# EAGLE design SnowBoard2 (EAGLE 8.1.1)
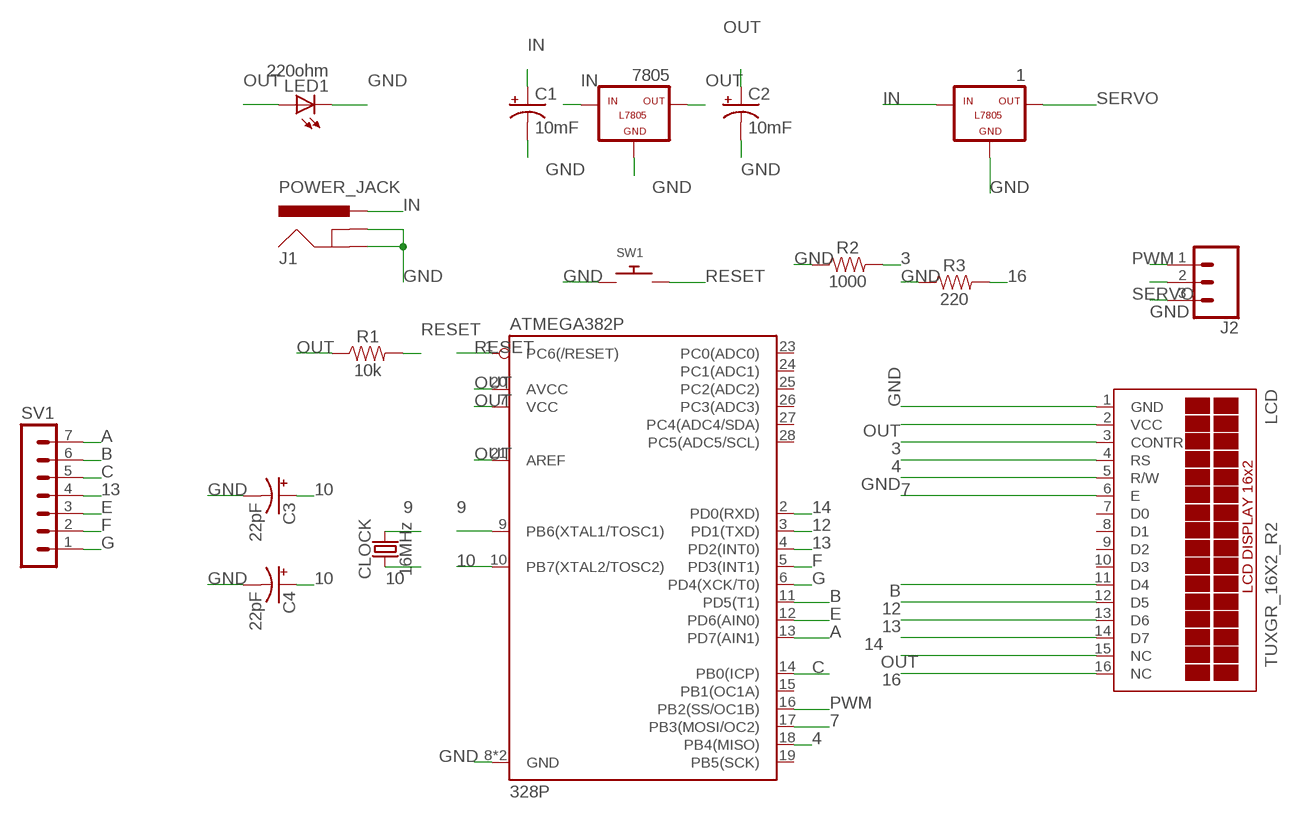
[diagram p0: schematic, sheet 1]

## Parts
1  L7805  [78XXL]
7805  L7805  [78XXL]
ATMEGA382P  328P  ATMEGA328P_PDIP  [DIP28]
C1  10mF  1000UF-RADIAL-5MM-25V-20%  [CPOL-RADIAL-5MM-10MM]
C2  10mF  1000UF-RADIAL-5MM-25V-20%  [CPOL-RADIAL-5MM-10MM]
C3  22pF  1000UF-RADIAL-5MM-25V-20%  [CPOL-RADIAL-5MM-10MM]
C4  22pF  1000UF-RADIAL-5MM-25V-20%  [CPOL-RADIAL-5MM-10MM]
CLOCK  16MHz  CRYSTAL-16MHZPTH-HC49US  [HC49US]
J1  POWER_JACK  [POWER_JACK_PTH]
J2  CONN_03-SCREW-5MM  [SCREWTERMINAL-5MM-3]
LCD  TUXGR_16X2_R2  [TUXGR_16X2_R2]
LED1  220ohm  LED5MM  [LED5MM]
R1  10k  1KOHM-VERT-1/4W-5%  [AXIAL-0.1]
R2  1000  100OHM-VERT_KIT-1/4W-1%  [AXIAL-0.1-KIT]
R3  220  100OHM-VERT_KIT-1/4W-1%  [AXIAL-0.1-KIT]
SV1  MA07-1  [MA07-1]
SW1  SWITCH_PUSHBUTTONEVQ-PE  [TACT_PANA-EVQ]

## Nets
3: LCD.3(CONTR) R2.P$2
4: ATMEGA382P.18(PB4(MISO)) LCD.4(RS)
7: ATMEGA382P.17(PB3(MOSI/OC2)) LCD.6(E)
9: ATMEGA382P.9(PB6(XTAL1/TOSC1)) CLOCK.2
10: ATMEGA382P.10(PB7(XTAL2/TOSC2)) C3.+ C4.+ CLOCK.1
12: ATMEGA382P.3(PD1(TXD)) LCD.12(D5)
13: ATMEGA382P.4(PD2(INT0)) LCD.13(D6) SV1.4
14: ATMEGA382P.2(PD0(RXD)) LCD.14(D7)
16: LCD.16(NC) R3.P$2
A: ATMEGA382P.13(PD7(AIN1)) SV1.7
B: ATMEGA382P.11(PD5(T1)) LCD.11(D4) SV1.6
C: ATMEGA382P.14(PB0(ICP)) SV1.5
E: ATMEGA382P.12(PD6(AIN0)) SV1.3
F: ATMEGA382P.5(PD3(INT1)) SV1.2
G: ATMEGA382P.6(PD4(XCK/T0)) SV1.1
GND: 1.GND 7805.GND ATMEGA382P.8(GND) ATMEGA382P.22(GND) C1.- C2.- C3.- C4.- J1.GND J1.GNDBREAK J2.3 LCD.1(GND) LCD.5(R/W) LED1.K(C) R2.P$1 R3.P$1 SW1.P$1
IN: 1.IN 7805.IN C1.+ J1.PWR
OUT: 7805.OUT ATMEGA382P.7(VCC) ATMEGA382P.20(AVCC) ATMEGA382P.21(AREF) C2.+ LCD.2(VCC) LCD.15(NC) LED1.A R1.P$1
PWM: ATMEGA382P.16(PB2(SS/OC1B)) J2.1
RESET: ATMEGA382P.1(PC6(/RESET)) R1.P$2 SW1.P$2
SERVO: 1.OUT J2.2
Unconnected: ATMEGA382P.15(PB1(OC1A)) ATMEGA382P.19(PB5(SCK)) ATMEGA382P.23(PC0(ADC0)) ATMEGA382P.24(PC1(ADC1)) ATMEGA382P.25(PC2(ADC2)) ATMEGA382P.26(PC3(ADC3)) ATMEGA382P.27(PC4(ADC4/SDA)) ATMEGA382P.28(PC5(ADC5/SCL)) LCD.7(D0) LCD.8(D1) LCD.9(D2) LCD.10(D3)

## Library data of the parts
1 7805 = tango:L7805: VOLTAGE REGULATOR
ATMEGA382P = SparkFun-IC-Microcontroller:ATMEGA328P_PDIP: Atmel 328P Through hole ATMEGA328P uC used in the Arduino 32kb flash, 1k EEPROM, 2k SRAM Datasheet <http://www.sparkfun.com/datasheets/Components/SMD/ATMega328.pdf> SparkFun Products Storefront component: AVR 28 Pin 20MHz 32K 6A/D - ATMega328P <https://www.sparkfun.com/products/9061> (COM-09061) SparkFun Simon Says - Through-Hole Soldering Kit <https://www.sparkfun.com/products/10547> (KIT-10547) SparkFun Learn to Solder - Simon Says <https://www.sparkfun.com/products/13708> (KIT-13708) SparkFun BigTime Watch Kit <https://www.sparkfun.com/products/11734> (KIT-11734) SparkFun ClockIt <https://www.sparkfun.com/products/10930> (KIT-10930) SparkFun Serial Enabled LCD Kit <https://www.sparkfun.com/products/10097> (LCD-10097) SparkFun Simon Tilts - Through Hole Soldering Kit <https://www.sparkfun.com/products/12634> (KIT-12634) SparkFun Frequency Counter Kit <https://www.sparkfun.com/products/10140> (KIT-10140) FabFM Radio Kit <https://www.sparkfun.com/products/11043> (KIT-11043) SparkFun Binary Blaster Kit <https://www.sparkfun.com/products/12037> (KIT-12037) SparkFun Metro-Gnome <https://www.sparkfun.com/products/9236> (KIT-09236) ATmega328 with Arduino Optiboot (Uno) <https://www.sparkfun.com/products/10524> (DEV-10524); PROD_ID: IC-09136
C1-C4 = SparkFun-Capacitors:1000UF: 1,000µF/1mF ceramic capacitors A capacitor is a passive two-terminal electrical component used to store electrical energy temporarily in an electric field. CAP-08070; PROD_ID: CAP-09538; VALUE: 1mF
CLOCK = SparkFun-Clocks:CRYSTAL-16MHZ: 16MHz Crystal Digikey Example <http://www.digikey.com/product-search/en?keywords=535-9122-1-ND> Frequency: 16MHz Frequency Stability: ±50ppm Frequency Tolerance: ±20ppm Load Capacitance: 18pF SparkFun Products: Pro Micro -5V/16MHz <https://www.sparkfun.com/products/12640> SparkFun Serial Enabled LCD Kit <https://www.sparkfun.com/products/10097>; PROD_ID: XTAL-08181; SF_ID: COM-00536
J1 = POWER_JACKPTH:POWER_JACK: Power Jack Connector This is the standard 5.5mm barrel jack for power. The PTH is the most common, proven, reliable, footprint. The Slot footprint only works if the mill layer is transmitted to the PCB fab house so be warned. Here are the connectors we sell at SparkFun: DC Barrel Power Jack/Connector <https://www.sparkfun.com/products/119> (PRT-00119) DC Barrel Power Jack/Connector (SMD) <https://www.sparkfun.com/products/12748> (PRT-12748) DC Barrel Jack Adapter - Breadboard Compatible <https://www.sparkfun.com/products/10811> (PRT-10811) It is used on this SparkFun product (and many, many others): SparkFun RedBoard - Programmed with Arduino <https://www.sparkfun.com/products/12757> (DEV-12757) Also, if you need a mating power supply or connector, please check these out: Wall Adapter Power Supply - 9VDC 650mA <https://www.sparkfun.com/products/298> (TOL-00298) DC Barrel Jack Adapter - Male <https://www.sparkfun.com/products/10287> (PRT-10287); PROD_ID: CONN-08197
J2 = SparkFun-Connectors:CONN_03: Multi connection point. Often used as Generic Header-pin footprint for 0.1 inch spaced/style header connections On any of the 0.1 inch spaced packages, you can populate with these: Break Away Headers - Straight <https://www.sparkfun.com/products/116> (PRT-00116) Break Away Male Headers - Right Angle <https://www.sparkfun.com/products/553> (PRT-00553) Female Headers <https://www.sparkfun.com/products/115> (PRT-00115) Break Away Headers - Machine Pin <https://www.sparkfun.com/products/117> (PRT-00117) Break Away Female Headers - Swiss Machine Pin <https://www.sparkfun.com/products/743> (PRT-00743) Stackable Header - 3 Pin (Female, 0.1") <https://www.sparkfun.com/products/13875> (PRT-13875) For SCREWTERMINALS and SPRING TERMINALS visit here: Screw Terimnals on SparkFun.com <https://www.sparkfun.com/search/results?term=Screw+Terminals> (5mm/3.5mm/2.54mm spacing) This device is also useful as a general connection point to wire up your design to another part of your project. Our various solder wires solder well into these plated through hole pads. Hook-Up Wire - Assortment (Stranded, 22 AWG) <https://www.sparkfun.com/products/11375> (PRT-11375) Hook-Up Wire - Assortment (Solid Core, 22 AWG) <https://www.sparkfun.com/products/11367> (PRT-11367) View the entire wire category on our website here <https://www.sparkfun.com/categories/141> Special notes: Molex polarized connector foot print use with SKU : PRT-08232 with associated crimp pins and housings.; PROD_ID: CONN-10134; SF_SKU: PRT-08433
LCD = display-lcd:TUXGR_16X2_R2: Tuxgraphics LCD display 16x2 characters reflective, without background light Source: tuxgr_12x2_r2.pdf; OC_FARNELL: unknown; OC_NEWARK: unknown
LED1 = adafruit:LED: LED OSRAM: - CHIPLED LG R971, LG N971, LY N971, LG Q971, LY Q971, LO R971, LY R971 LH N974, LH R974 LS Q976, LO Q976, LY Q976 LO Q996 - Hyper CHIPLED LW Q18S LB Q993, LB Q99A, LB R99A - SideLED LS A670, LO A670, LY A670, LG A670, LP A670 LB A673, LV A673, LT A673, LW A673 LH A674 LY A675 LS A676, LA A676, LO A676, LY A676, LW A676 LS A679, LY A679, LG A679 - Hyper Micro SIDELED® LS Y876, LA Y876, LO Y876, LY Y876 LT Y87S - SmartLED LW L88C, LW L88S LB L89C, LB L89S, LG L890 LS L89K, LO L89K, LY L89K LS L896, LA L896, LO L896, LY L896 - TOPLED LS T670, LO T670, LY T670, LG T670, LP T670 LSG T670, LSP T670, LSY T670, LOP T670, LYG T670 LG T671, LOG T671, LSG T671 LB T673, LV T673, LT T673, LW T673 LH T674 LS T676, LA T676, LO T676, LY T676, LB T676, LH T676, LSB T676, LW T676 LB T67C, LV T67C, LT T67C, LS T67K, LO T67K, LY T67K, LW E67C LS E67B, LA E67B, LO E67B, LY E67B, LB E67C, LV E67C, LT E67C LW T67C LS T679, LY T679, LG T679 LS T770, LO T770, LY T770, LG T770, LP T770 LB T773, LV T773, LT T773, LW T773 LH T774 LS E675, LA E675, LY E675, LS T675 LS T776, LA T776, LO T776, LY T776, LB T776 LHGB T686 LT T68C, LB T68C - Hyper Mini TOPLED® LB M676 - Mini TOPLED Santana® LG M470 LS M47K, LO M47K, LY M47K Source: http://www.osram.convergy.de/
R1 = SparkFun-Resistors:1KOHM: 1kΩ resistor A resistor is a passive two-terminal electrical component that implements electrical resistance as a circuit element. Resistors act to reduce current flow, and, at the same time, act to lower voltage levels within circuits. - Wikipedia; PROD_ID: RES-08380; VALUE: 1k
R2 R3 = SparkFun-Resistors:100OHM: 100Ω resistor A resistor is a passive two-terminal electrical component that implements electrical resistance as a circuit element. Resistors act to reduce current flow, and, at the same time, act to lower voltage levels within circuits. - Wikipedia; PROD_ID: RES-12181; VALUE: 100
SV1 = con-lstb:MA07-1: PIN HEADER; OC_FARNELL: unknown; OC_NEWARK: unknown
SW1 = adafruit:SWITCH_PUSHBUTTON: Buttons SOFTTOUCHSMD_SJ - Soft touch temporary push button (Super Junk Akihabara) Compatible with SKPMANE010 [Mouser: 688-SKPMAN] C&K_KSS = Digikey: KSS221GLFS

## Board
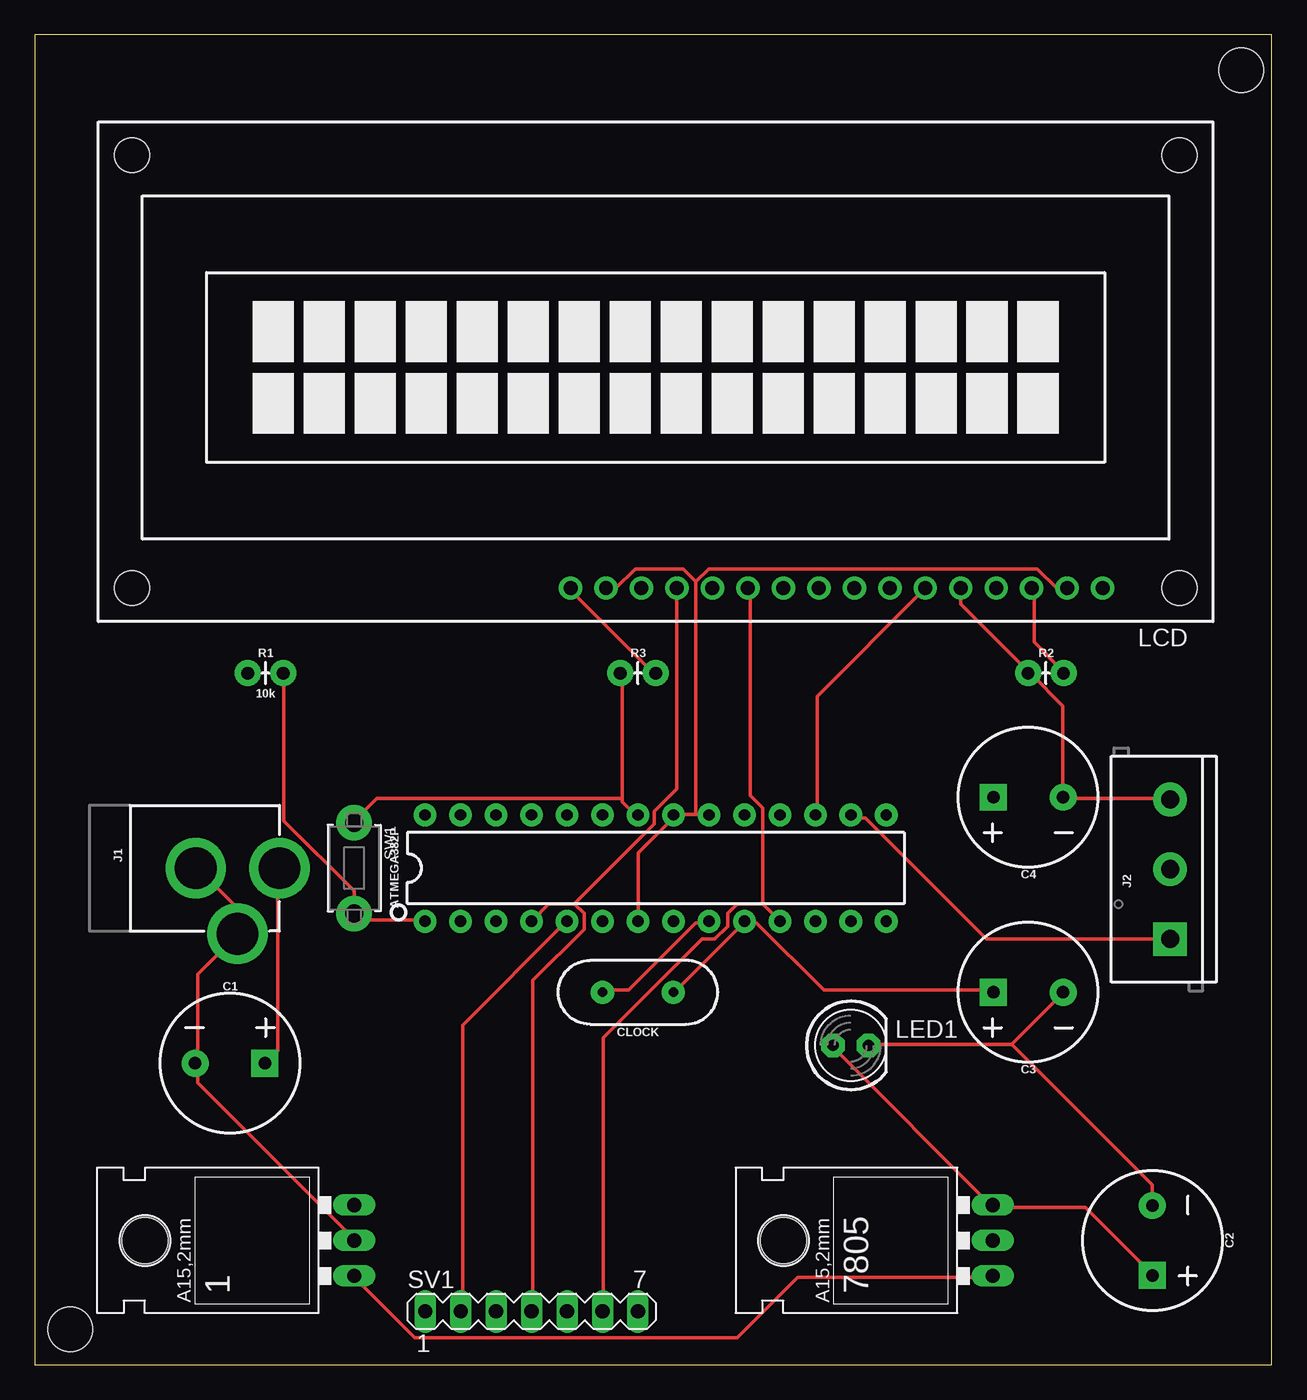
[diagram p1: board, top side]
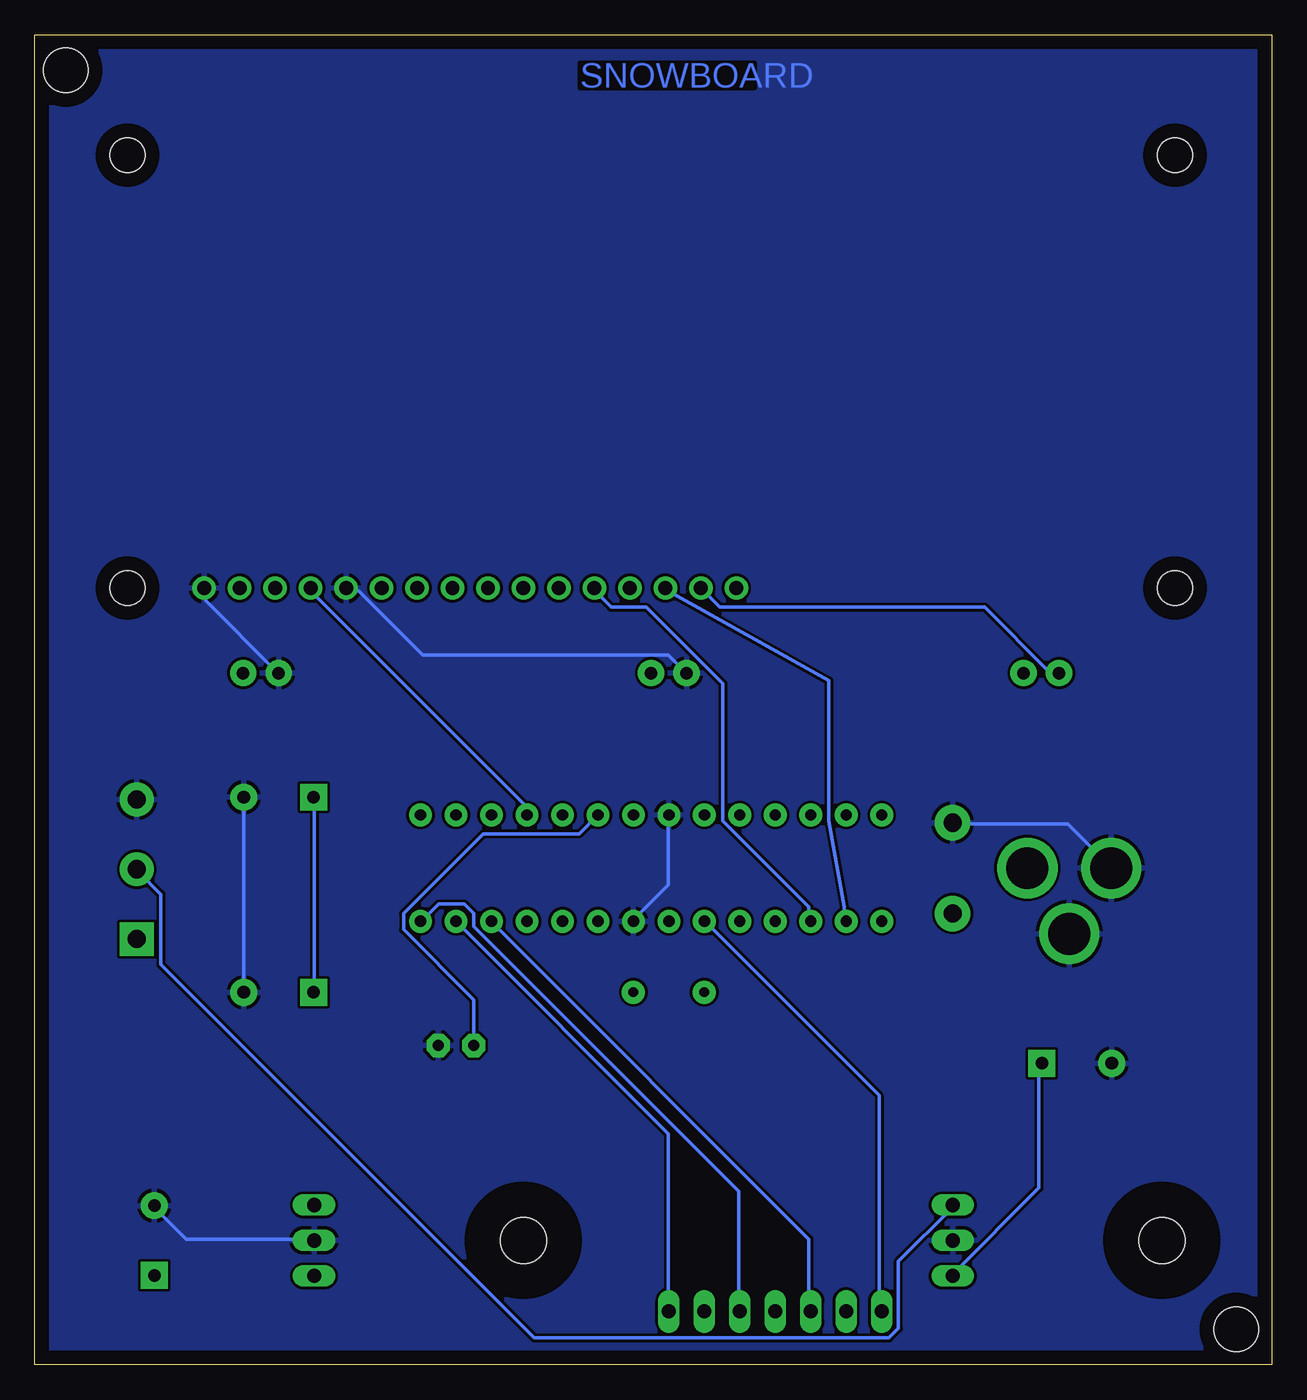
[diagram p2: board, bottom side, seen from below]

Size 88.57 x 95.24 mm. Coordinates in mm from the lower left corner, seen from the top.
Outline: 0,0 88.57,0 88.57,95.24 0,95.24 0,0
Copper layers (1*16): Top 0.045mm / dielectric 2mm / Bottom 0.045mm
Design rules "default *": minimum track width 10mil, minimum drill 24mil, track to track 8mil, track to pad 8mil, pad to pad 8mil, via to via 8mil, smd to smd 8mil, copper to edge 40mil, drill to drill 8mil, minimum pad ring 10mil, minimum via ring 8mil, stop-mask expansion 4mil, vias tented up to drill 0mil, thermal gap 10mil
Holes 3.2 mm at 2.54,2.54 86.36,92.71

### Footprints (pad centres in the part's own frame; a part is rotated, then mirrored left to right if it is on the bottom)
78XXL = drill 1.016 long: GND 0,-3.81; IN -2.54,-3.81; OUT 2.54,-3.81 | hole 3.302: 0,11.176
DIP28 = drill 0.813 pad 1.626: 1 -16.51,-3.81; 2 -13.97,-3.81; 3 -11.43,-3.81; 4 -8.89,-3.81; 5 -6.35,-3.81; 6 -3.81,-3.81; 7 -1.27,-3.81; 8 1.27,-3.81; 9 3.81,-3.81; 10 6.35,-3.81; 11 8.89,-3.81; 12 11.43,-3.81; 13 13.97,-3.81; 14 16.51,-3.81; 15 16.51,3.81; 16 13.97,3.81; 17 11.43,3.81; 18 8.89,3.81; 19 6.35,3.81; 20 3.81,3.81; 21 1.27,3.81; 22 -1.27,3.81; 23 -3.81,3.81; 24 -6.35,3.81; 25 -8.89,3.81; 26 -11.43,3.81; 27 -13.97,3.81; 28 -16.51,3.81
CPOL-RADIAL-5MM-10MM = drill 0.9 pad 1.93 square: + 2.5,0 | drill 0.9 pad 1.93: - -2.5,0
HC49US = drill 0.7 pad 1.651: 1 -2.54,0; 2 2.54,0
POWER_JACK_PTH = drill 2.997 pad 4.318: GND 0,7.7; GNDBREAK 4.7,10.7; PWR 0,13.7
SCREWTERMINAL-5MM-3 = drill 1.3 pad 2.413 square: 1 0,0 | drill 1.3 pad 2.413: 2 5,0; 3 10,0
TUXGR_16X2_R2 = drill 1 pad 1.676: 1 -32,15.5; 2 -29.46,15.5; 3 -26.92,15.5; 4 -24.38,15.5; 5 -21.84,15.5; 6 -19.3,15.5; 7 -16.76,15.5; 8 -14.22,15.5; 9 -11.68,15.5; 10 -9.14,15.5; 11 -6.6,15.5; 12 -4.06,15.5; 13 -1.52,15.5; 14 1.02,15.5; 15 3.56,15.5; 16 6.1,15.5 | hole 2.5: -37.5,-15.5; 37.5,-15.5; -37.5,15.5; 37.5,15.5
LED5MM = drill 0.813 pad 1.676 octagon: A -1.27,0; K 1.27,0
AXIAL-0.1 = drill 0.9 pad 1.88: P$1 -1.27,0; P$2 1.27,0
AXIAL-0.1-KIT = drill 0.9 pad 1.88: P$1 -1.27,0; P$2 1.27,0
MA07-1 = drill 1.016 long: 1 -7.62,0; 2 -5.08,0; 3 -2.54,0; 4 0,0; 5 2.54,0; 6 5.08,0; 7 7.62,0
TACT_PANA-EVQ = drill 1.3 pad 2.54: P$1 -3.25,0; P$2 3.25,0

### Placement (x,y rotation side)
1  19.05,8.89 90 top
7805  64.77,8.89 90 top
ATMEGA382P  44.45,35.56 0 top
C1  13.97,21.59 0 top
C2  80.01,8.89 270 top
C3  71.12,26.67 180 top
C4  71.12,40.64 180 top
CLOCK  43.18,26.67 180 top
J1  3.81,35.56 270 top
J2  81.28,30.48 90 top
LCD  44.45,71.12 180 top
LED1  58.42,22.86 0 top
R1  16.51,49.53 0 top
R2  72.39,49.53 0 top
R3  43.18,49.53 0 top
SV1  35.56,3.81 0 top
SW1  22.86,35.56 270 top

### Tracks (layer width: path | path; a pad name or v marks a point on that pad's centre or on a via)
3
  Top 0.254: LCD.3 71.55,55.4 71.55,51.74 73.61,49.68 R2.P$2
4
  Bottom 0.254: ATMEGA382P.18 53.49,39.39 53.49,40.08 68.81,55.4 LCD.4
7
  Top 0.254: ATMEGA382P.17 56.01,39.39 56.01,47.85 63.55,55.4 LCD.6
9
  Top 0.254: ATMEGA382P.9 48.23,31.62 47.32,31.62 42.52,26.82 40.69,26.82 CLOCK.2
10
  Top 0.254: CLOCK.1 45.72,26.59 50.75,31.62 ATMEGA382P.10 50.98,31.62 51.66,31.62 56.46,26.82 68.58,26.82 C3.+
  Bottom 0.254: C3.+ 68.58,26.82 68.58,40.54 C4.+
12
  Bottom 0.254: ATMEGA382P.3 33.15,31.85 33.15,32.77 39.32,38.94 39.32,48.77 44.81,54.25 47.32,54.25 48.46,55.4 LCD.12
13
  Top 0.254: 38.63,32.99 39.32,32.31 39.32,31.17 35.66,27.51 35.66,3.96 SV1.4 | 38.63,32.99 36.8,32.99 ATMEGA382P.4 | 38.63,32.99 44.35,38.71 44.35,39.62 45.95,41.22 45.95,55.4 LCD.13
14
  Bottom 0.254: ATMEGA382P.2 30.63,31.85 30.63,32.77 31.73,38.94 31.73,49 43.2,55.4 LCD.14
16
  Top 0.254: LCD.16 38.41,55.4 44.35,49.45 R3.P$2
A
  Bottom 0.254: ATMEGA382P.13 43.2,16.53 43.2,3.96 SV1.7
B
  Top 0.254: 52.12,32.99 50.29,32.99 49.61,32.31 49.61,31.39 48.69,30.48 47.78,30.48 40.69,23.39 40.69,3.96 SV1.6 | 52.12,32.99 53.26,31.85 ATMEGA382P.11 | 52.12,32.99 52.12,39.85 51.21,40.77 51.21,55.4 LCD.11
C
  Bottom 0.254: SV1.5 38.18,3.96 38.18,12.42 57.15,31.39 57.15,32.31 57.84,32.99 59.66,32.99 60.81,31.85 ATMEGA382P.14
E
  Bottom 0.254: SV1.3 33.15,3.96 33.15,8.99 55.78,31.62 ATMEGA382P.12
F
  Top 0.254: SV1.2 30.63,3.96 30.63,24.31 37.95,31.62 ATMEGA382P.5
G
  Bottom 0.254: SV1.1 28.12,3.96 28.12,19.28 40.46,31.62 ATMEGA382P.6
GND
  Top 0.254: J2.3 81.15,40.54 73.84,40.54 C4.- 73.61,40.77 73.61,47.17 71.32,49.45 R2.P$1 71.09,49.68 66.29,54.48 66.29,55.4 LCD.5 | 69.95,22.94 59.89,22.94 LED1.K | 69.95,22.94 73.61,26.59 C3.- | C2.- 80.01,12.88 69.95,22.94 | 1.GND 22.86,8.99 11.66,20.19 11.66,21.56 C1.- 11.66,21.79 11.66,27.96 14.4,30.71 J1.GNDBREAK 14.4,30.94 14.4,32.77 11.66,35.51 J1.GND | 42.06,40.54 42.06,40.31 42.98,39.39 ATMEGA382P.22 | 42.06,40.54 42.06,49.45 R3.P$1 | 42.06,40.54 24.46,40.54 22.86,38.94 SW1.P$1
  Bottom 0.254: LCD.1 76.35,55.4 76.35,54.71 71.32,49.68 R2.P$1 | 7805.GND 68.58,8.99 77.72,8.99 80.01,11.28 C2.- | C4.- 73.61,40.54 73.61,26.82 C3.- | ATMEGA382P.22 43.2,39.17 43.2,34.37 45.72,31.85 ATMEGA382P.8 | SW1.P$1 22.86,38.71 14.63,38.71 11.66,35.74 J1.GND | R3.P$1 43.2,50.82 60.81,50.82 65.38,55.4 66.06,55.4 LCD.5
  pour Bottom: -1.27,96.52 90.17,96.52 90.17,-2.54 -1.27,-2.54
IN
  Top 0.254: 7805.IN 68.58,6.25 54.63,6.25 50.29,1.9 27.2,1.9 22.86,6.25 1.IN | J1.PWR 17.37,35.51 17.37,22.48 16.69,21.79 C1.+
  Bottom 0.254: 1.IN 22.86,6.48 16.69,12.65 16.69,21.56 C1.+
OUT
  Top 0.254: 68.58,11.28 75.21,11.28 80.01,6.48 C2.+ | 68.58,11.28 57.15,22.71 LED1.A | 68.58,11.28 7805.OUT | ATMEGA382P.7 43.2,31.85 43.2,36.65 45.72,39.17 ATMEGA382P.21 45.72,39.39 47.32,39.39 | 47.32,39.39 48.23,39.39 ATMEGA382P.20 | 47.32,56.08 46.41,57 42.98,57 41.61,55.63 40.92,55.63 LCD.15 | 47.32,39.39 47.32,56.08 | 47.32,56.08 48.23,57 71.78,57 73.15,55.63 73.84,55.63 LCD.2
  Bottom 0.254: R1.P$1 15.32,49.68 16,49.68 20.57,54.25 39.55,54.25 40.69,55.4 LCD.15 | LED1.A 57.15,26.14 62.18,31.17 62.18,32.31 56.46,38.02 49.61,38.02 ATMEGA382P.20
PWM
  Top 0.254: J2.1 68.12,30.48 59.44,39.17 58.52,39.17 ATMEGA382P.16
RESET
  Top 0.254: ATMEGA382P.1 27.89,31.85 23.32,31.85 SW1.P$2 22.86,33.91 17.83,38.94 17.83,49.45 R1.P$2
SERVO
  Bottom 0.254: 1.OUT 22.86,11.28 26.75,7.39 26.75,2.59 27.43,1.9 52.81,1.9 79.55,28.65 79.55,33.68 81.15,35.28 J2.2

### Text on the board
Bottom: SNOWBOARD